# Altium schematic sheet REGENIX_IO_EXPANDER.SchDoc
size Tabloid; SheetNumber: 10; SheetTotal: 17; Sheet_Name: Insert name in Document Parameters; Size: 11x17
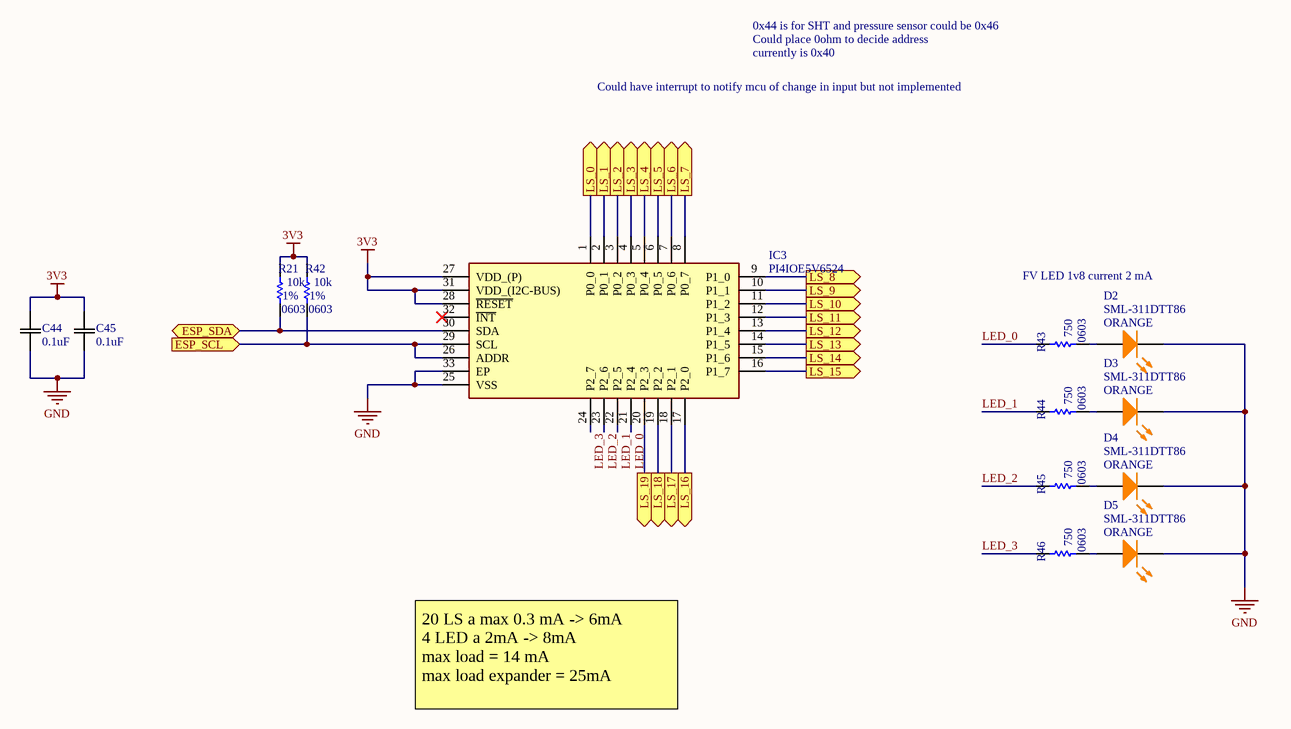
[diagram p0: REGENIX_IO_EXPANDER.SchDoc]

## Parts
C44  0.1uF  [CAP_CL10_SAM]
C45  0.1uF  [CAP_CL10_SAM]
D2  SML-311DTT86  value ORANGE  [LED_0603]
D3  SML-311DTT86  value ORANGE  [LED_0603]
D4  SML-311DTT86  value ORANGE  [LED_0603]
D5  SML-311DTT86  value ORANGE  [LED_0603]
IC3  PI4IOE5V6524  [QFN50P500X500X80-33N-D]
R21  value 10k  Package: 0603  Precision: 1%  [RES_0603]  (hidden comment: RES - 0603)
R42  value 10k  Package: 0603  Precision: 1%  [RES_0603]  (hidden comment: RES - 0603)
R43  value 750  Package: 0603  [RES_0603]  (hidden comment: RES - 0603)
R44  value 750  Package: 0603  [RES_0603]  (hidden comment: RES - 0603)
R45  value 750  Package: 0603  [RES_0603]  (hidden comment: RES - 0603)
R46  value 750  Package: 0603  [RES_0603]  (hidden comment: RES - 0603)

## Ports
ESP_SCL (in), ESP_SDA (bidir), LS_0 (out), LS_1 (out), LS_2 (out), LS_3 (out), LS_4 (out), LS_5 (out), LS_6 (out), LS_7 (out), LS_8 (out), LS_9 (out), LS_10 (out), LS_11 (out), LS_12 (out), LS_13 (out), LS_14 (out), LS_15 (out), LS_16 (out), LS_17 (out), LS_18 (out), LS_19 (out)

## Nets
3V3: C44.2 C45.2 IC3.27(VDD_(P)) IC3.28(~{RESET}) IC3.31(VDD_(I2C-BUS)) R21.2 R42.2
GND: C44.1 C45.1 D2.K D3.K D4.K D5.K IC3.25(VSS) IC3.33(EP)
ESP_SCL: IC3.26(ADDR) IC3.29(SCL) R42.1 ; port ESP_SCL
ESP_SDA: IC3.30(SDA) R21.1 ; port ESP_SDA
LED_0: IC3.21(P2_4) R43.2
LED_1: IC3.22(P2_5) R44.2
LED_2: IC3.23(P2_6) R45.2
LED_3: IC3.24(P2_7) R46.2
LS_0: IC3.1(P0_0) ; port LS_0
LS_1: IC3.2(P0_1) ; port LS_1
LS_2: IC3.3(P0_2) ; port LS_2
LS_3: IC3.4(P0_3) ; port LS_3
LS_4: IC3.5(P0_4) ; port LS_4
LS_5: IC3.6(P0_5) ; port LS_5
LS_6: IC3.7(P0_6) ; port LS_6
LS_7: IC3.8(P0_7) ; port LS_7
LS_8: IC3.9(P1_0) ; port LS_8
LS_9: IC3.10(P1_1) ; port LS_9
LS_10: IC3.11(P1_2) ; port LS_10
LS_11: IC3.12(P1_3) ; port LS_11
LS_12: IC3.13(P1_4) ; port LS_12
LS_13: IC3.14(P1_5) ; port LS_13
LS_14: IC3.15(P1_6) ; port LS_14
LS_15: IC3.16(P1_7) ; port LS_15
LS_16: IC3.17(P2_0) ; port LS_16
LS_17: IC3.18(P2_1) ; port LS_17
LS_18: IC3.19(P2_2) ; port LS_18
LS_19: IC3.20(P2_3) ; port LS_19
NetD2_A: D2.A R43.1
NetD3_A: D3.A R44.1
NetD4_A: D4.A R45.1
NetD5_A: D5.A R46.1

Not connected (* = marked no-connect by the designer): IC3 32(~{INT})*

## Notes on the sheet
- 0x44 is for SHT and pressure sensor could be 0x46
- Could have interrupt to notify mcu of change in input but not implemented
- currently is 0x40
- Could place 0ohm to decide address
- FV LED 1v8 current 2 mA
- 20 LS a max 0.3 mA -> 6mA                     4 LED a 2mA -> 8mA                  max load = 14 mA                      max load expander = 25mA
- Sheet Name
- Project Title
- Global Project
- Size
- Group
- Revision
- Date
- Sheet
- of
- Filename
- Designers

## Library data of the parts
C44 C45 = CL10B104KB8NNWC: CAP CER 0.1UF 50V X7R 0603 CL10B104KB8NNWC; Mfr_Name: Samsung
D2-D5 = LED_SML-311DTT86: LED - 611nM ORANGE 2mA - 0603; Voltage: 1.8V; Mfg: ROHM Semiconductor; Power: 44mW; Current: 2mA; HelpURL: http://media.digikey.com/pdf/Data%20Sheets/Rohm%20PDFs/SML-311%20Series.pdf; CreatedBy: Jonathan Bouchard; Temperature: -40°C to 85°C; Package: 0603; Precision: *; Mfg Part Number: SML-311DTT86; Supplier 1: Digikey; Supplier Part Number 1: 511-1303-1-ND
IC3 = PI4IOE5V6524: Integrated Circuit; Manufacturer_Name: Diodes Incorporated; Datasheet Link: https://www.diodes.com/assets/Datasheets/PI4IOE5V6524.pdf; Height: 0.8mm; Manufacturer_Part_Number: PI4IOE5V6524
R43-R46 = RES - 0603: Precision: 1%; Current: *; CreatedBy: Jonathan Bouchard
R21 R42 = RES - 0603: Current: *; CreatedBy: Jonathan Bouchard